# Altium project Electronic Load.PrjPcb (part 3 of 3)
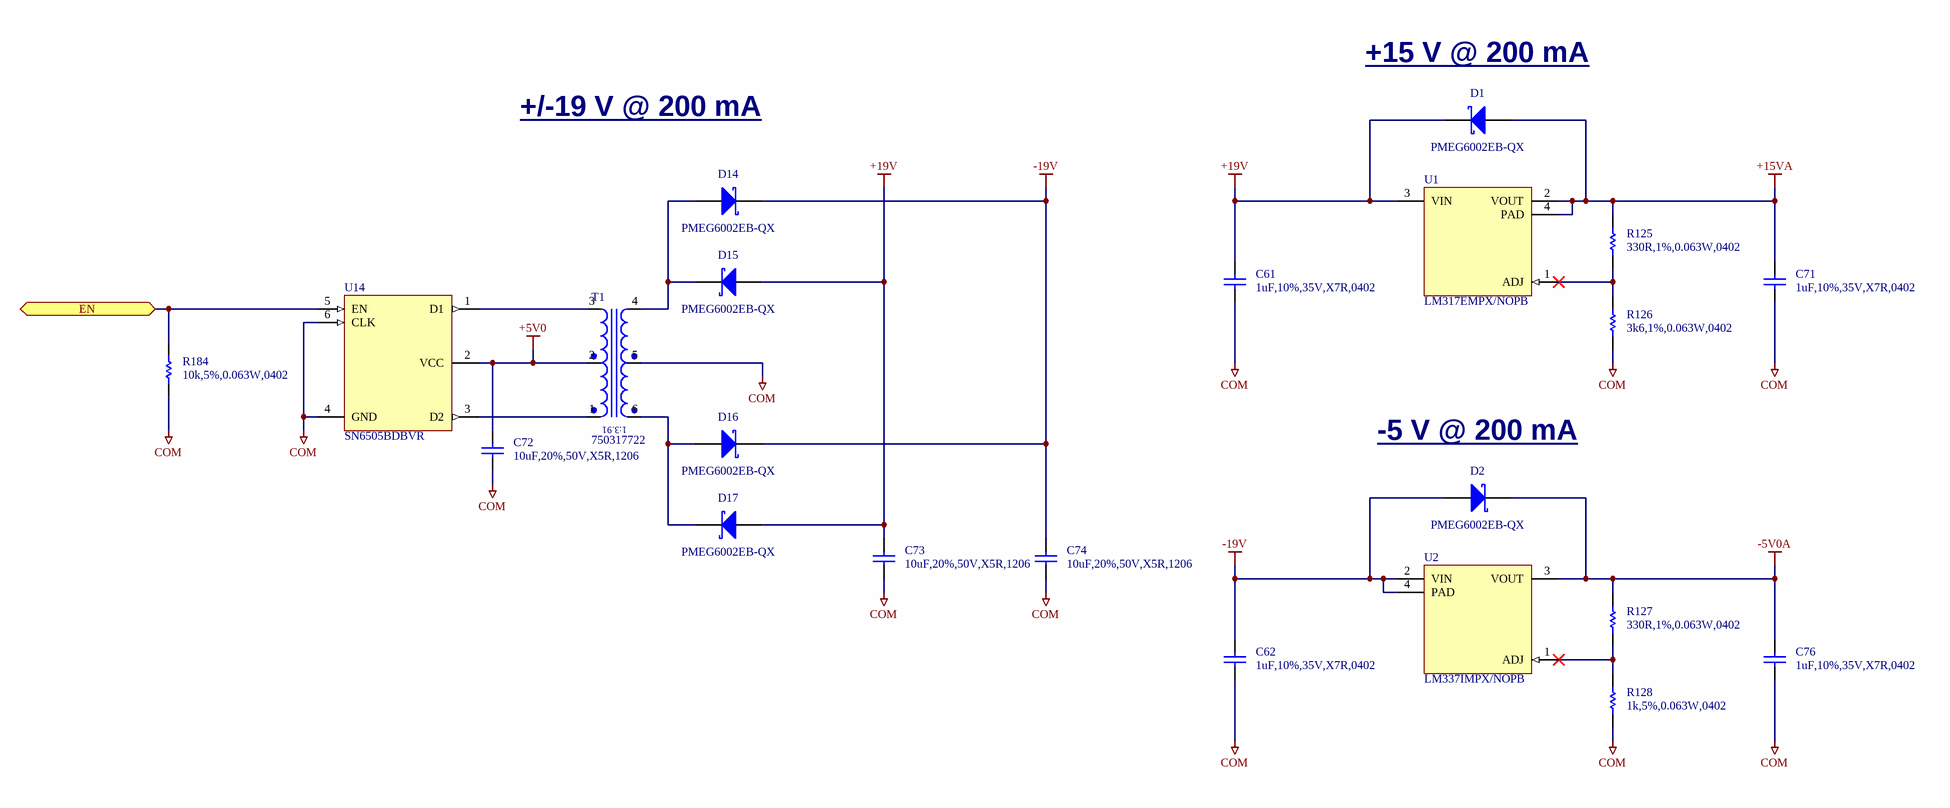
[diagram p14: Power Page 2.SchDoc]

## Nets that join several sheets
+3V00REF: DAC (C23.2 U5.3 U6.2), MCU (FB2.2)
+3V3: CLG/CL1/PT (C20_CLG_CL1_PT.2 U4_CLG_CL1_PT.1), DAC (C21.2 FB5.2 R165.1 U5.8), CLG/CL2/PT (C20_CLG_CL2_PT.2 U4_CLG_CL2_PT.1), CLG/CL3/PT (C20_CLG_CL3_PT.2 U4_CLG_CL3_PT.1), CLG/CL5/PT (C20_CLG_CL5_PT.2 U4_CLG_CL5_PT.1), CLG/CL6/PT (C20_CLG_CL6_PT.2 U4_CLG_CL6_PT.1), CLG/CL4/PT (C20_CLG_CL4_PT.2 U4_CLG_CL4_PT.1), CLG/CL7/PT (C20_CLG_CL7_PT.2 U4_CLG_CL7_PT.1), CLG/CL8/PT (C20_CLG_CL8_PT.2 U4_CLG_CL8_PT.1), CLG/CT/C1 (D11_C1.2), CLG/CT/C2 (D11_C2.2), CLG/CT/C3 (D11_C3.2), CLG/CT/C4 (D11_C4.2), CLG/CT/C5 (D11_C5.2), CLG/CT/C6 (D11_C6.2), CLG/CT/C7 (D11_C7.2), CLG/CT/C8 (D11_C8.2), CLG/CT/C9 (D11_C9.2), CLG/CT/C10 (D11_C10.2), MCU (19 pins), Power Page 1 (5 pins), User Interface (14 pins)
+5V0: Power Page 1 (10 pins), User Interface (9 pins), Power Page 2 (C72.2 T1.2 U14.2)
+15VA: CLG/CL1/ICC (C15_CLG_CL1_ICC.2 U3_CLG_CL1_ICC.8), DAC (C9.2 U9.8), CLG/CL2/ICC (C15_CLG_CL2_ICC.2 U3_CLG_CL2_ICC.8), CLG/CL3/ICC (C15_CLG_CL3_ICC.2 U3_CLG_CL3_ICC.8), CLG/CL5/ICC (C15_CLG_CL5_ICC.2 U3_CLG_CL5_ICC.8), CLG/CL6/ICC (C15_CLG_CL6_ICC.2 U3_CLG_CL6_ICC.8), CLG/CL4/ICC (C15_CLG_CL4_ICC.2 U3_CLG_CL4_ICC.8), Voltage Sense (6 pins), CLG/CL7/ICC (C15_CLG_CL7_ICC.2 U3_CLG_CL7_ICC.8), CLG/CL8/ICC (C15_CLG_CL8_ICC.2 U3_CLG_CL8_ICC.8), Power Page 2 (5 pins)
-5V0A: CLG/CL1/ICC (C16_CLG_CL1_ICC.2 U3_CLG_CL1_ICC.4), DAC (C10.2 U9.4), CLG/CL2/ICC (C16_CLG_CL2_ICC.2 U3_CLG_CL2_ICC.4), CLG/CL3/ICC (C16_CLG_CL3_ICC.2 U3_CLG_CL3_ICC.4), CLG/CL5/ICC (C16_CLG_CL5_ICC.2 U3_CLG_CL5_ICC.4), CLG/CL6/ICC (C16_CLG_CL6_ICC.2 U3_CLG_CL6_ICC.4), CLG/CL4/ICC (C16_CLG_CL4_ICC.2 U3_CLG_CL4_ICC.4), Voltage Sense (6 pins), CLG/CL7/ICC (C16_CLG_CL7_ICC.2 U3_CLG_CL7_ICC.4), CLG/CL8/ICC (C16_CLG_CL8_ICC.2 U3_CLG_CL8_ICC.4), Power Page 2 (C76.2 D2.1 R127.2 U2.3)
COM: CLG/CL1/ICC (7 pins), CLG/CL1/PT (5 pins), DAC (12 pins), CLG/CL2/ICC (7 pins), CLG/CL2/PT (5 pins), CLG/CL3/ICC (7 pins), CLG/CL3/PT (5 pins), CLG/CL5/ICC (7 pins), CLG/CL5/PT (5 pins), CLG/CL6/ICC (7 pins), CLG/CL6/PT (5 pins), CLG/CL4/ICC (7 pins), CLG/CL4/PT (5 pins), Voltage Sense (7 pins), CLG/CL7/ICC (7 pins), CLG/CL7/PT (5 pins), CLG/CL8/ICC (7 pins), CLG/CL8/PT (5 pins), CLG/CT/C1 (D11_C1.1), CLG/CT/C2 (D11_C2.1), CLG/CT/C3 (D11_C3.1), CLG/CT/C4 (D11_C4.1), CLG/CT/C5 (D11_C5.1), CLG/CT/C6 (D11_C6.1), CLG/CT/C7 (D11_C7.1), CLG/CT/C8 (D11_C8.1), CLG/CT/C9 (D11_C9.1), CLG/CT/C10 (D11_C10.1), MCU (36 pins), Power Page 1 (35 pins), User Interface (55 pins), Power Page 2 (13 pins)
VUSB: Power Page 1 (5 pins), User Interface (FB3.2 FB4.2)
ADC.CH1: CLG/CT/C1 (R112_C1.1), MCU (U7.20)
ADC.CH2: CLG/CT/C2 (R112_C2.1), MCU (U7.30)
ADC.CH3: CLG/CT/C3 (R112_C3.1), MCU (U7.17)
ADC.CH4: CLG/CT/C4 (R112_C4.1), MCU (U7.25)
ADC.CH5: CLG/CT/C5 (R112_C5.1), MCU (U7.15)
ADC.CH6: CLG/CT/C6 (R112_C6.1), MCU (U7.21)
ADC.CH7: CLG/CT/C7 (R112_C7.1), MCU (U7.16)
ADC.CH8: CLG/CT/C8 (R112_C8.1), MCU (U7.18)
ADC.CH9: CLG/CT/C9 (R112_C9.1), MCU (U7.22)
ADC.CH10: CLG/CT/C10 (R112_C10.1), MCU (U7.27)
BTN.B1: MCU (U7.67), User Interface (R154.1 SW3.3 SW3.4)
BTN.B2: MCU (U7.66), User Interface (R155.1 SW5.3 SW5.4)
BTN.B3: MCU (U7.65), User Interface (R156.1 SW8.3 SW8.4)
BTN.B4: MCU (U7.68), User Interface (R157.1 SW9.3 SW9.4)
BTN.B5: MCU (U7.82), User Interface (R161.1 SW4.3 SW4.4)
BTN.B6: MCU (U7.81), User Interface (R160.1 SW6.3 SW6.4)
BTN.B7: MCU (U7.80), User Interface (R159.1 SW7.3 SW7.4)
BTN.B8: MCU (U7.79), User Interface (R158.1 SW10.3 SW10.4)
DAC.CS_N: DAC (R165.2 U5.4), MCU (U7.2)
DAC.SCLK: DAC (R166.1 U5.5), MCU (U7.1)
DAC.SDI: DAC (R167.1 U5.6), MCU (U7.5)
GPWR_EN: MCU (U7.94), Power Page 2 (R184.1 U14.5)
LATCH: MCU (U7.86), Power Page 1 (R119.1)
LCD.BKLT: MCU (U7.53), User Interface (U18.5)
LCD.DB0: MCU (U7.62), User Interface (U19.1)
LCD.DB1: MCU (U7.61), User Interface (U19.3)
LCD.DB2: MCU (U7.60), User Interface (U19.4)
LCD.DB3: MCU (U7.59), User Interface (U19.5)
LCD.DB4: MCU (U7.58), User Interface (U19.6)
LCD.DB5: MCU (U7.57), User Interface (U19.7)
LCD.DB6: MCU (U7.56), User Interface (U19.8)
LCD.DB7: MCU (U7.55), User Interface (U19.9)
LCD.E: MCU (U7.52), User Interface (U18.4)
LCD.OE: MCU (U7.54), User Interface (R183.2 U18.8 U19.10)
LCD.R/W: MCU (U7.51), User Interface (U18.3)
LCD.RS: MCU (U7.50), User Interface (U18.2)
LOAD+: Electronic Load Top (6 pins), CLG/CL1/PT (Q4_CLG_CL1_PT.2), CLG/CL2/PT (Q4_CLG_CL2_PT.2), CLG/CL3/PT (Q4_CLG_CL3_PT.2), CLG/CL5/PT (Q4_CLG_CL5_PT.2), CLG/CL6/PT (Q4_CLG_CL6_PT.2), CLG/CL4/PT (Q4_CLG_CL4_PT.2), Voltage Sense (R96.2), CLG/CL7/PT (Q4_CLG_CL7_PT.2), CLG/CL8/PT (Q4_CLG_CL8_PT.2)
LOAD-: Electronic Load Top (6 pins), CLG/CL1/CS (12 pins), CLG/CL2/CS (12 pins), CLG/CL3/CS (12 pins), CLG/CL5/CS (12 pins), CLG/CL6/CS (12 pins), CLG/CL4/CS (12 pins), Voltage Sense (C45.2 R17.1 R101.1), CLG/CL7/CS (12 pins), CLG/CL8/CS (12 pins)
NetC1_CLG_CL1_ICC_2: CLG/CL1/ICC (C1_CLG_CL1_ICC.2 R1_CLG_CL1_ICC.1 R2_CLG_CL1_ICC.2), CLG/CT/C1 (R111_C1.2)
NetC1_CLG_CL2_ICC_2: CLG/CL2/ICC (C1_CLG_CL2_ICC.2 R1_CLG_CL2_ICC.1 R2_CLG_CL2_ICC.2), CLG/CT/C2 (R111_C2.2)
NetC1_CLG_CL3_ICC_2: CLG/CL3/ICC (C1_CLG_CL3_ICC.2 R1_CLG_CL3_ICC.1 R2_CLG_CL3_ICC.2), CLG/CT/C3 (R111_C3.2)
NetC1_CLG_CL4_ICC_2: CLG/CL4/ICC (C1_CLG_CL4_ICC.2 R1_CLG_CL4_ICC.1 R2_CLG_CL4_ICC.2), CLG/CT/C4 (R111_C4.2)
NetC1_CLG_CL5_ICC_2: CLG/CL5/ICC (C1_CLG_CL5_ICC.2 R1_CLG_CL5_ICC.1 R2_CLG_CL5_ICC.2), CLG/CT/C5 (R111_C5.2)
NetC1_CLG_CL6_ICC_2: CLG/CL6/ICC (C1_CLG_CL6_ICC.2 R1_CLG_CL6_ICC.1 R2_CLG_CL6_ICC.2), CLG/CT/C6 (R111_C6.2)
NetC1_CLG_CL7_ICC_2: CLG/CL7/ICC (C1_CLG_CL7_ICC.2 R1_CLG_CL7_ICC.1 R2_CLG_CL7_ICC.2), CLG/CT/C7 (R111_C7.2)
NetC1_CLG_CL8_ICC_2: CLG/CL8/ICC (C1_CLG_CL8_ICC.2 R1_CLG_CL8_ICC.1 R2_CLG_CL8_ICC.2), CLG/CT/C8 (R111_C8.2)
NetC4_1: Voltage Sense (C4.1 R12.2 U8.7), CLG/CT/C9 (R111_C9.2)
NetC14_CLG_CL1_ICC_2: CLG/CL1/ICC (C14_CLG_CL1_ICC.2 U3_CLG_CL1_ICC.7), CLG/CL1/PT (R81_CLG_CL1_PT.1)
NetC14_CLG_CL2_ICC_2: CLG/CL2/ICC (C14_CLG_CL2_ICC.2 U3_CLG_CL2_ICC.7), CLG/CL2/PT (R81_CLG_CL2_PT.1)
NetC14_CLG_CL3_ICC_2: CLG/CL3/ICC (C14_CLG_CL3_ICC.2 U3_CLG_CL3_ICC.7), CLG/CL3/PT (R81_CLG_CL3_PT.1)
NetC14_CLG_CL4_ICC_2: CLG/CL4/ICC (C14_CLG_CL4_ICC.2 U3_CLG_CL4_ICC.7), CLG/CL4/PT (R81_CLG_CL4_PT.1)
NetC14_CLG_CL5_ICC_2: CLG/CL5/ICC (C14_CLG_CL5_ICC.2 U3_CLG_CL5_ICC.7), CLG/CL5/PT (R81_CLG_CL5_PT.1)
NetC14_CLG_CL6_ICC_2: CLG/CL6/ICC (C14_CLG_CL6_ICC.2 U3_CLG_CL6_ICC.7), CLG/CL6/PT (R81_CLG_CL6_PT.1)
NetC14_CLG_CL7_ICC_2: CLG/CL7/ICC (C14_CLG_CL7_ICC.2 U3_CLG_CL7_ICC.7), CLG/CL7/PT (R81_CLG_CL7_PT.1)
NetC14_CLG_CL8_ICC_2: CLG/CL8/ICC (C14_CLG_CL8_ICC.2 U3_CLG_CL8_ICC.7), CLG/CL8/PT (R81_CLG_CL8_PT.1)
NetC46_1: Voltage Sense (C46.1 R11.1 R103.2 U8.1), CLG/CT/C10 (R111_C10.2)
NetR33_CLG_CL1_ICC_1: CLG/CL1/ICC (R33_CLG_CL1_ICC.1), DAC (U9.1 U9.2), CLG/CL2/ICC (R33_CLG_CL2_ICC.1), CLG/CL3/ICC (R33_CLG_CL3_ICC.1), CLG/CL5/ICC (R33_CLG_CL5_ICC.1), CLG/CL6/ICC (R33_CLG_CL6_ICC.1), CLG/CL4/ICC (R33_CLG_CL4_ICC.1), CLG/CL7/ICC (R33_CLG_CL7_ICC.1), CLG/CL8/ICC (R33_CLG_CL8_ICC.1)
PROG.RST_N: MCU (C39.2 R94.1 R95.2 U7.14), User Interface (R173.1)
PROG.SWCLK: MCU (U7.77), User Interface (R169.1)
PROG.SWDIO: MCU (U7.76), User Interface (R168.1)
PROG.SWO: MCU (U7.90), User Interface (R170.1)
PROG.TDI: MCU (U7.78), User Interface (R171.1)
PWR: MCU (U7.70), Power Page 1 (D31.2 R117.1)
SHUNT.SH1_N: CLG/CL1/ICC (R26_CLG_CL1_ICC.2), CLG/CL1/CS (NT12_CLG_CL1_CS.1)
SHUNT.SH1_N: CLG/CL2/ICC (R26_CLG_CL2_ICC.2), CLG/CL2/CS (NT12_CLG_CL2_CS.1)
SHUNT.SH1_N: CLG/CL3/ICC (R26_CLG_CL3_ICC.2), CLG/CL3/CS (NT12_CLG_CL3_CS.1)
SHUNT.SH1_N: CLG/CL5/ICC (R26_CLG_CL5_ICC.2), CLG/CL5/CS (NT12_CLG_CL5_CS.1)
SHUNT.SH1_N: CLG/CL6/ICC (R26_CLG_CL6_ICC.2), CLG/CL6/CS (NT12_CLG_CL6_CS.1)
SHUNT.SH1_N: CLG/CL4/ICC (R26_CLG_CL4_ICC.2), CLG/CL4/CS (NT12_CLG_CL4_CS.1)
SHUNT.SH1_N: CLG/CL7/ICC (R26_CLG_CL7_ICC.2), CLG/CL7/CS (NT12_CLG_CL7_CS.1)
SHUNT.SH1_N: CLG/CL8/ICC (R26_CLG_CL8_ICC.2), CLG/CL8/CS (NT12_CLG_CL8_CS.1)
SHUNT.SH1_P: CLG/CL1/ICC (R31_CLG_CL1_ICC.2), CLG/CL1/CS (NT11_CLG_CL1_CS.1)
SHUNT.SH1_P: CLG/CL2/ICC (R31_CLG_CL2_ICC.2), CLG/CL2/CS (NT11_CLG_CL2_CS.1)
SHUNT.SH1_P: CLG/CL3/ICC (R31_CLG_CL3_ICC.2), CLG/CL3/CS (NT11_CLG_CL3_CS.1)
SHUNT.SH1_P: CLG/CL5/ICC (R31_CLG_CL5_ICC.2), CLG/CL5/CS (NT11_CLG_CL5_CS.1)
SHUNT.SH1_P: CLG/CL6/ICC (R31_CLG_CL6_ICC.2), CLG/CL6/CS (NT11_CLG_CL6_CS.1)
SHUNT.SH1_P: CLG/CL4/ICC (R31_CLG_CL4_ICC.2), CLG/CL4/CS (NT11_CLG_CL4_CS.1)
SHUNT.SH1_P: CLG/CL7/ICC (R31_CLG_CL7_ICC.2), CLG/CL7/CS (NT11_CLG_CL7_CS.1)
SHUNT.SH1_P: CLG/CL8/ICC (R31_CLG_CL8_ICC.2), CLG/CL8/CS (NT11_CLG_CL8_CS.1)
SHUNT.SH2_N: CLG/CL1/ICC (R27_CLG_CL1_ICC.2), CLG/CL1/CS (NT10_CLG_CL1_CS.1)
SHUNT.SH2_N: CLG/CL2/ICC (R27_CLG_CL2_ICC.2), CLG/CL2/CS (NT10_CLG_CL2_CS.1)
SHUNT.SH2_N: CLG/CL3/ICC (R27_CLG_CL3_ICC.2), CLG/CL3/CS (NT10_CLG_CL3_CS.1)
SHUNT.SH2_N: CLG/CL5/ICC (R27_CLG_CL5_ICC.2), CLG/CL5/CS (NT10_CLG_CL5_CS.1)
SHUNT.SH2_N: CLG/CL6/ICC (R27_CLG_CL6_ICC.2), CLG/CL6/CS (NT10_CLG_CL6_CS.1)
SHUNT.SH2_N: CLG/CL4/ICC (R27_CLG_CL4_ICC.2), CLG/CL4/CS (NT10_CLG_CL4_CS.1)
SHUNT.SH2_N: CLG/CL7/ICC (R27_CLG_CL7_ICC.2), CLG/CL7/CS (NT10_CLG_CL7_CS.1)
SHUNT.SH2_N: CLG/CL8/ICC (R27_CLG_CL8_ICC.2), CLG/CL8/CS (NT10_CLG_CL8_CS.1)
SHUNT.SH2_P: CLG/CL1/ICC (R32_CLG_CL1_ICC.2), CLG/CL1/CS (NT9_CLG_CL1_CS.1)
SHUNT.SH2_P: CLG/CL2/ICC (R32_CLG_CL2_ICC.2), CLG/CL2/CS (NT9_CLG_CL2_CS.1)
SHUNT.SH2_P: CLG/CL3/ICC (R32_CLG_CL3_ICC.2), CLG/CL3/CS (NT9_CLG_CL3_CS.1)
SHUNT.SH2_P: CLG/CL5/ICC (R32_CLG_CL5_ICC.2), CLG/CL5/CS (NT9_CLG_CL5_CS.1)
SHUNT.SH2_P: CLG/CL6/ICC (R32_CLG_CL6_ICC.2), CLG/CL6/CS (NT9_CLG_CL6_CS.1)
SHUNT.SH2_P: CLG/CL4/ICC (R32_CLG_CL4_ICC.2), CLG/CL4/CS (NT9_CLG_CL4_CS.1)
SHUNT.SH2_P: CLG/CL7/ICC (R32_CLG_CL7_ICC.2), CLG/CL7/CS (NT9_CLG_CL7_CS.1)
SHUNT.SH2_P: CLG/CL8/ICC (R32_CLG_CL8_ICC.2), CLG/CL8/CS (NT9_CLG_CL8_CS.1)
SHUNT.SH3_N: CLG/CL1/ICC (R28_CLG_CL1_ICC.2), CLG/CL1/CS (NT8_CLG_CL1_CS.1)
SHUNT.SH3_N: CLG/CL2/ICC (R28_CLG_CL2_ICC.2), CLG/CL2/CS (NT8_CLG_CL2_CS.1)
SHUNT.SH3_N: CLG/CL3/ICC (R28_CLG_CL3_ICC.2), CLG/CL3/CS (NT8_CLG_CL3_CS.1)
SHUNT.SH3_N: CLG/CL5/ICC (R28_CLG_CL5_ICC.2), CLG/CL5/CS (NT8_CLG_CL5_CS.1)
SHUNT.SH3_N: CLG/CL6/ICC (R28_CLG_CL6_ICC.2), CLG/CL6/CS (NT8_CLG_CL6_CS.1)
SHUNT.SH3_N: CLG/CL4/ICC (R28_CLG_CL4_ICC.2), CLG/CL4/CS (NT8_CLG_CL4_CS.1)
SHUNT.SH3_N: CLG/CL7/ICC (R28_CLG_CL7_ICC.2), CLG/CL7/CS (NT8_CLG_CL7_CS.1)
SHUNT.SH3_N: CLG/CL8/ICC (R28_CLG_CL8_ICC.2), CLG/CL8/CS (NT8_CLG_CL8_CS.1)
SHUNT.SH3_P: CLG/CL1/ICC (R35_CLG_CL1_ICC.2), CLG/CL1/CS (NT7_CLG_CL1_CS.1)
SHUNT.SH3_P: CLG/CL2/ICC (R35_CLG_CL2_ICC.2), CLG/CL2/CS (NT7_CLG_CL2_CS.1)
SHUNT.SH3_P: CLG/CL3/ICC (R35_CLG_CL3_ICC.2), CLG/CL3/CS (NT7_CLG_CL3_CS.1)
SHUNT.SH3_P: CLG/CL5/ICC (R35_CLG_CL5_ICC.2), CLG/CL5/CS (NT7_CLG_CL5_CS.1)
SHUNT.SH3_P: CLG/CL6/ICC (R35_CLG_CL6_ICC.2), CLG/CL6/CS (NT7_CLG_CL6_CS.1)
SHUNT.SH3_P: CLG/CL4/ICC (R35_CLG_CL4_ICC.2), CLG/CL4/CS (NT7_CLG_CL4_CS.1)
SHUNT.SH3_P: CLG/CL7/ICC (R35_CLG_CL7_ICC.2), CLG/CL7/CS (NT7_CLG_CL7_CS.1)
SHUNT.SH3_P: CLG/CL8/ICC (R35_CLG_CL8_ICC.2), CLG/CL8/CS (NT7_CLG_CL8_CS.1)
SHUNT.SH4_N: CLG/CL1/ICC (R29_CLG_CL1_ICC.2), CLG/CL1/CS (NT6_CLG_CL1_CS.1)
SHUNT.SH4_N: CLG/CL2/ICC (R29_CLG_CL2_ICC.2), CLG/CL2/CS (NT6_CLG_CL2_CS.1)
SHUNT.SH4_N: CLG/CL3/ICC (R29_CLG_CL3_ICC.2), CLG/CL3/CS (NT6_CLG_CL3_CS.1)
SHUNT.SH4_N: CLG/CL5/ICC (R29_CLG_CL5_ICC.2), CLG/CL5/CS (NT6_CLG_CL5_CS.1)
SHUNT.SH4_N: CLG/CL6/ICC (R29_CLG_CL6_ICC.2), CLG/CL6/CS (NT6_CLG_CL6_CS.1)
SHUNT.SH4_N: CLG/CL4/ICC (R29_CLG_CL4_ICC.2), CLG/CL4/CS (NT6_CLG_CL4_CS.1)
SHUNT.SH4_N: CLG/CL7/ICC (R29_CLG_CL7_ICC.2), CLG/CL7/CS (NT6_CLG_CL7_CS.1)
SHUNT.SH4_N: CLG/CL8/ICC (R29_CLG_CL8_ICC.2), CLG/CL8/CS (NT6_CLG_CL8_CS.1)
SHUNT.SH4_P: CLG/CL1/ICC (R36_CLG_CL1_ICC.2), CLG/CL1/CS (NT5_CLG_CL1_CS.1)
SHUNT.SH4_P: CLG/CL2/ICC (R36_CLG_CL2_ICC.2), CLG/CL2/CS (NT5_CLG_CL2_CS.1)
SHUNT.SH4_P: CLG/CL3/ICC (R36_CLG_CL3_ICC.2), CLG/CL3/CS (NT5_CLG_CL3_CS.1)
SHUNT.SH4_P: CLG/CL5/ICC (R36_CLG_CL5_ICC.2), CLG/CL5/CS (NT5_CLG_CL5_CS.1)
SHUNT.SH4_P: CLG/CL6/ICC (R36_CLG_CL6_ICC.2), CLG/CL6/CS (NT5_CLG_CL6_CS.1)
SHUNT.SH4_P: CLG/CL4/ICC (R36_CLG_CL4_ICC.2), CLG/CL4/CS (NT5_CLG_CL4_CS.1)
SHUNT.SH4_P: CLG/CL7/ICC (R36_CLG_CL7_ICC.2), CLG/CL7/CS (NT5_CLG_CL7_CS.1)
SHUNT.SH4_P: CLG/CL8/ICC (R36_CLG_CL8_ICC.2), CLG/CL8/CS (NT5_CLG_CL8_CS.1)
SHUNT.SH5_N: CLG/CL1/ICC (R3_CLG_CL1_ICC.2), CLG/CL1/CS (NT4_CLG_CL1_CS.1)
SHUNT.SH5_N: CLG/CL2/ICC (R3_CLG_CL2_ICC.2), CLG/CL2/CS (NT4_CLG_CL2_CS.1)
SHUNT.SH5_N: CLG/CL3/ICC (R3_CLG_CL3_ICC.2), CLG/CL3/CS (NT4_CLG_CL3_CS.1)
SHUNT.SH5_N: CLG/CL5/ICC (R3_CLG_CL5_ICC.2), CLG/CL5/CS (NT4_CLG_CL5_CS.1)
SHUNT.SH5_N: CLG/CL6/ICC (R3_CLG_CL6_ICC.2), CLG/CL6/CS (NT4_CLG_CL6_CS.1)
SHUNT.SH5_N: CLG/CL4/ICC (R3_CLG_CL4_ICC.2), CLG/CL4/CS (NT4_CLG_CL4_CS.1)
SHUNT.SH5_N: CLG/CL7/ICC (R3_CLG_CL7_ICC.2), CLG/CL7/CS (NT4_CLG_CL7_CS.1)
SHUNT.SH5_N: CLG/CL8/ICC (R3_CLG_CL8_ICC.2), CLG/CL8/CS (NT4_CLG_CL8_CS.1)
SHUNT.SH5_P: CLG/CL1/ICC (R4_CLG_CL1_ICC.2), CLG/CL1/CS (NT3_CLG_CL1_CS.1)
SHUNT.SH5_P: CLG/CL2/ICC (R4_CLG_CL2_ICC.2), CLG/CL2/CS (NT3_CLG_CL2_CS.1)
SHUNT.SH5_P: CLG/CL3/ICC (R4_CLG_CL3_ICC.2), CLG/CL3/CS (NT3_CLG_CL3_CS.1)
SHUNT.SH5_P: CLG/CL5/ICC (R4_CLG_CL5_ICC.2), CLG/CL5/CS (NT3_CLG_CL5_CS.1)
SHUNT.SH5_P: CLG/CL6/ICC (R4_CLG_CL6_ICC.2), CLG/CL6/CS (NT3_CLG_CL6_CS.1)
SHUNT.SH5_P: CLG/CL4/ICC (R4_CLG_CL4_ICC.2), CLG/CL4/CS (NT3_CLG_CL4_CS.1)
SHUNT.SH5_P: CLG/CL7/ICC (R4_CLG_CL7_ICC.2), CLG/CL7/CS (NT3_CLG_CL7_CS.1)
SHUNT.SH5_P: CLG/CL8/ICC (R4_CLG_CL8_ICC.2), CLG/CL8/CS (NT3_CLG_CL8_CS.1)
SHUNT.SH6_N: CLG/CL1/ICC (R7_CLG_CL1_ICC.2), CLG/CL1/CS (NT2_CLG_CL1_CS.1)
SHUNT.SH6_N: CLG/CL2/ICC (R7_CLG_CL2_ICC.2), CLG/CL2/CS (NT2_CLG_CL2_CS.1)
SHUNT.SH6_N: CLG/CL3/ICC (R7_CLG_CL3_ICC.2), CLG/CL3/CS (NT2_CLG_CL3_CS.1)
SHUNT.SH6_N: CLG/CL5/ICC (R7_CLG_CL5_ICC.2), CLG/CL5/CS (NT2_CLG_CL5_CS.1)
SHUNT.SH6_N: CLG/CL6/ICC (R7_CLG_CL6_ICC.2), CLG/CL6/CS (NT2_CLG_CL6_CS.1)
SHUNT.SH6_N: CLG/CL4/ICC (R7_CLG_CL4_ICC.2), CLG/CL4/CS (NT2_CLG_CL4_CS.1)
SHUNT.SH6_N: CLG/CL7/ICC (R7_CLG_CL7_ICC.2), CLG/CL7/CS (NT2_CLG_CL7_CS.1)
SHUNT.SH6_N: CLG/CL8/ICC (R7_CLG_CL8_ICC.2), CLG/CL8/CS (NT2_CLG_CL8_CS.1)
SHUNT.SH6_P: CLG/CL1/ICC (R8_CLG_CL1_ICC.2), CLG/CL1/CS (NT1_CLG_CL1_CS.1)
SHUNT.SH6_P: CLG/CL2/ICC (R8_CLG_CL2_ICC.2), CLG/CL2/CS (NT1_CLG_CL2_CS.1)
SHUNT.SH6_P: CLG/CL3/ICC (R8_CLG_CL3_ICC.2), CLG/CL3/CS (NT1_CLG_CL3_CS.1)
SHUNT.SH6_P: CLG/CL5/ICC (R8_CLG_CL5_ICC.2), CLG/CL5/CS (NT1_CLG_CL5_CS.1)
SHUNT.SH6_P: CLG/CL6/ICC (R8_CLG_CL6_ICC.2), CLG/CL6/CS (NT1_CLG_CL6_CS.1)
SHUNT.SH6_P: CLG/CL4/ICC (R8_CLG_CL4_ICC.2), CLG/CL4/CS (NT1_CLG_CL4_CS.1)
SHUNT.SH6_P: CLG/CL7/ICC (R8_CLG_CL7_ICC.2), CLG/CL7/CS (NT1_CLG_CL7_CS.1)
SHUNT.SH6_P: CLG/CL8/ICC (R8_CLG_CL8_ICC.2), CLG/CL8/CS (NT1_CLG_CL8_CS.1)
SOURCE: CLG/CL1/CS (12 pins), CLG/CL1/PT (Q4_CLG_CL1_PT.3 R18_CLG_CL1_PT.2)
SOURCE: CLG/CL2/CS (12 pins), CLG/CL2/PT (Q4_CLG_CL2_PT.3 R18_CLG_CL2_PT.2)
SOURCE: CLG/CL3/CS (12 pins), CLG/CL3/PT (Q4_CLG_CL3_PT.3 R18_CLG_CL3_PT.2)
SOURCE: CLG/CL5/CS (12 pins), CLG/CL5/PT (Q4_CLG_CL5_PT.3 R18_CLG_CL5_PT.2)
SOURCE: CLG/CL6/CS (12 pins), CLG/CL6/PT (Q4_CLG_CL6_PT.3 R18_CLG_CL6_PT.2)
SOURCE: CLG/CL4/CS (12 pins), CLG/CL4/PT (Q4_CLG_CL4_PT.3 R18_CLG_CL4_PT.2)
SOURCE: CLG/CL7/CS (12 pins), CLG/CL7/PT (Q4_CLG_CL7_PT.3 R18_CLG_CL7_PT.2)
SOURCE: CLG/CL8/CS (12 pins), CLG/CL8/PT (Q4_CLG_CL8_PT.3 R18_CLG_CL8_PT.2)
STAT: MCU (U7.3), Power Page 1 (D12.2 R121.2)
TEMP.T1: CLG/CL1/PT (C19_CLG_CL1_PT.2 R83_CLG_CL1_PT.1), MCU (U7.38)
TEMP.T2: CLG/CL2/PT (C19_CLG_CL2_PT.2 R83_CLG_CL2_PT.1), MCU (U7.39)
TEMP.T3: CLG/CL3/PT (C19_CLG_CL3_PT.2 R83_CLG_CL3_PT.1), MCU (U7.41)
TEMP.T4: CLG/CL4/PT (C19_CLG_CL4_PT.2 R83_CLG_CL4_PT.1), MCU (U7.40)
TEMP.T5: CLG/CL5/PT (C19_CLG_CL5_PT.2 R83_CLG_CL5_PT.1), MCU (U7.42)
TEMP.T6: CLG/CL6/PT (C19_CLG_CL6_PT.2 R83_CLG_CL6_PT.1), MCU (U7.45)
TEMP.T7: CLG/CL7/PT (C19_CLG_CL7_PT.2 R83_CLG_CL7_PT.1), MCU (U7.43)
TEMP.T8: CLG/CL8/PT (C19_CLG_CL8_PT.2 R83_CLG_CL8_PT.1), MCU (U7.44)
UART.RXD: MCU (U7.46), User Interface (R175.2)
UART.TXD: MCU (U7.47), User Interface (R174.2)
USB.D_N: MCU (U7.72), User Interface (J4.A7 J4.B7 U16.2 U16.9)
USB.D_P: MCU (U7.73), User Interface (J4.A6 J4.B6 U16.1 U16.10)

## Assembly variants
Production: not fitted Q4_PT1 Q4_PT2 Q4_PT3 Q4_PT4 Q4_PT5 Q4_PT6 Q4_PT7 Q4_PT8